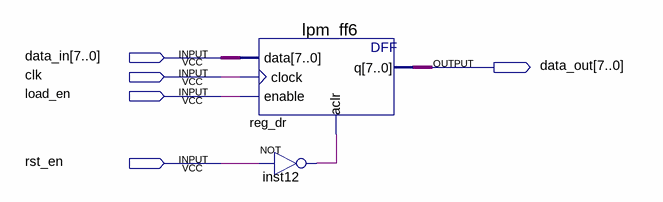
[diagram p0: schematic sheet]
// Quartus schematic dr_unit.bdf as structural Verilog: 2 symbols, 5 pins
module dr_unit (
  input  [7:0] data_in,
  input  clk,
  input  load_en,
  input  rst_en,
  output [7:0] data_out
);

  wire inst12_out;

  lpm_ff6 reg_dr (.data(data_in), .clock(clk), .enable(load_en), .aclr(inst12_out), .q(data_out));
  not inst12 (inst12_out, rst_en);
endmodule
